# Altium project Motor_Driver_Model_D203.PrjPcb (part 1 of 2)
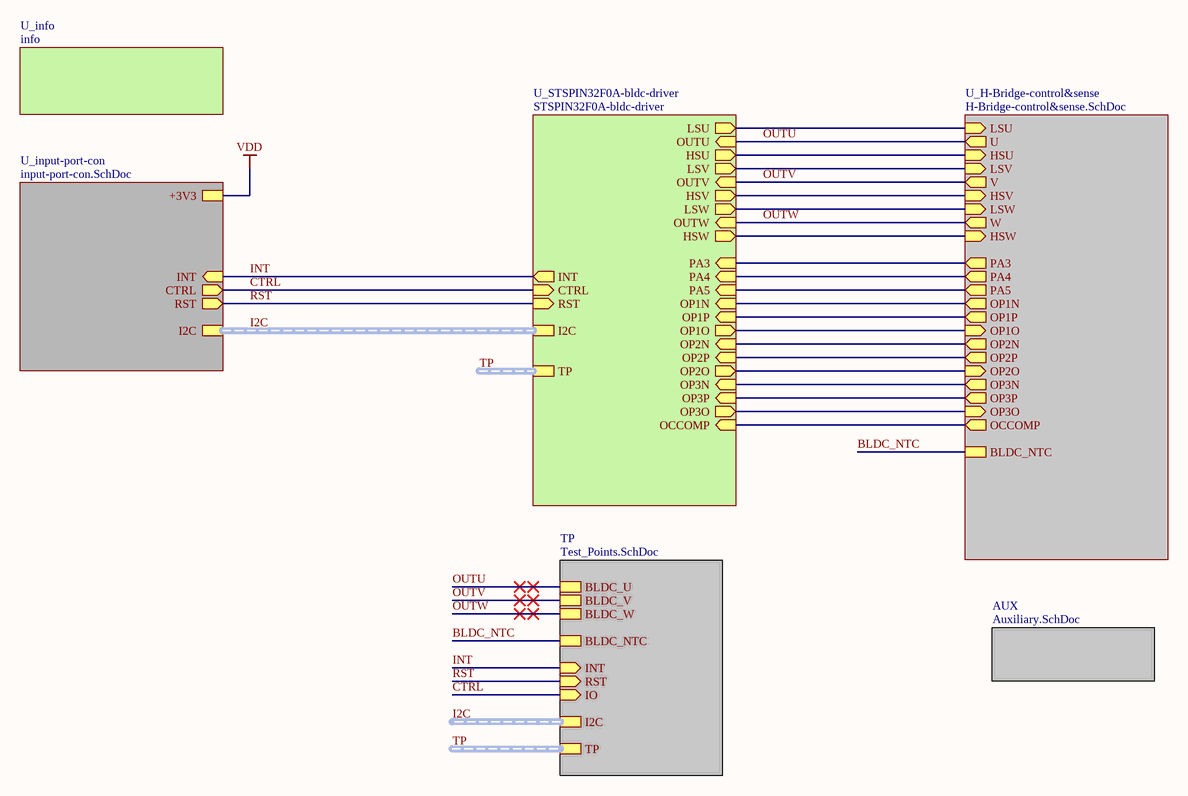
[diagram p0: Top_Motor_Driver_Model_D203.SchDoc]
_Title: D203_Motor_Driver; _Revision: 0.1; _PCBNumber: 001; _PCBModel: D203; _HWEngineer: SGU; _DocumentDate: 20213105; _DateCode: 2021.30; _CompanyName: Acme_CPU; _BoardName: Motor_Driver; _address2: Sheridan WY 82801; _address1: 30 N Gould St suite 4000
7 sheets, 106 parts. Net scope: hierarchical (ports join the sheet entries above them; power ports are global).
Board file: Motor_Driver_Model_D203.PcbDoc
Sheets:
  Top_Motor_Driver_Model_D203.SchDoc
    TP = Test_Points.SchDoc
    AUX = Auxiliary.SchDoc
    U_input-port-con = input-port-con.SchDoc
    U_H-Bridge-control&sense = H-Bridge-control&sense.SchDoc
  SWD_TagConnect.SchDoc
    U_TC2030-NL_TagConnect_6-pin = TC2030-NL_TagConnect_6-pin.SchDoc

## Sheet Top_Motor_Driver_Model_D203.SchDoc: TOP-Motor-Driver-Sch
size A4; DocumentNumber: 2; SheetNumber: 2; SheetTotal: 8

### Sub-sheets
AUX = Auxiliary.SchDoc: no entries
TP = Test_Points.SchDoc: BLDC_U, BLDC_W, BLDC_V, I2C (harness I2C), BLDC_NTC, TP (harness TP), INT (in), RST (in), IO (in)
U_H-Bridge-control&sense = H-Bridge-control&sense.SchDoc: U (out), V (out), W (out), PA3 (out), PA4 (out), PA5 (out), OP1N (out), OP1P (out), OP1O (in), OP2N (out), OP2P (out), OP2O (in), OP3N (out), OP3P (out), OP3O (in), OCCOMP (out), HSU (in), LSU (in), HSV (in), LSV (in), HSW (in), LSW (in), BLDC_NTC
U_info = info (file not in this document): no entries
U_input-port-con = input-port-con.SchDoc: I2C (harness I2C), INT (in), RST (out), CTRL (out), +3V3
U_STSPIN32F0A-bldc-driver = STSPIN32F0A-bldc-driver (file not in this document): TP (harness TP), LSU (out), OUTU (in), HSU (out), LSV (out), OUTV (in), HSV (out), LSW (out), OUTW (in), HSW (out), RST (in), INT (out), CTRL (in), I2C (harness I2C), PA3 (in), PA4 (in), PA5 (in), OP1N (in), OP1P (in), OP1O (out), OP2N (in), OP2P (in), OP2O (out), OP3N (in), OP3P (in), OP3O (out), OCCOMP (in)

### Nets
BLDC_NTC: sheet TP/BLDC_NTC, sheet U_H-Bridge-control&sense/BLDC_NTC
CTRL: sheet TP/IO, sheet U_input-port-con/CTRL, sheet U_STSPIN32F0A-bldc-driver/CTRL
HSU: sheet U_H-Bridge-control&sense/HSU, sheet U_STSPIN32F0A-bldc-driver/HSU
HSV: sheet U_H-Bridge-control&sense/HSV, sheet U_STSPIN32F0A-bldc-driver/HSV
HSW: sheet U_H-Bridge-control&sense/HSW, sheet U_STSPIN32F0A-bldc-driver/HSW
INT: sheet TP/INT, sheet U_input-port-con/INT, sheet U_STSPIN32F0A-bldc-driver/INT
LSU: sheet U_H-Bridge-control&sense/LSU, sheet U_STSPIN32F0A-bldc-driver/LSU
LSV: sheet U_H-Bridge-control&sense/LSV, sheet U_STSPIN32F0A-bldc-driver/LSV
LSW: sheet U_H-Bridge-control&sense/LSW, sheet U_STSPIN32F0A-bldc-driver/LSW
OCCOMP: sheet U_H-Bridge-control&sense/OCCOMP, sheet U_STSPIN32F0A-bldc-driver/OCCOMP
OP1N: sheet U_H-Bridge-control&sense/OP1N, sheet U_STSPIN32F0A-bldc-driver/OP1N
OP1O: sheet U_H-Bridge-control&sense/OP1O, sheet U_STSPIN32F0A-bldc-driver/OP1O
OP1P: sheet U_H-Bridge-control&sense/OP1P, sheet U_STSPIN32F0A-bldc-driver/OP1P
OP2N: sheet U_H-Bridge-control&sense/OP2N, sheet U_STSPIN32F0A-bldc-driver/OP2N
OP2O: sheet U_H-Bridge-control&sense/OP2O, sheet U_STSPIN32F0A-bldc-driver/OP2O
OP2P: sheet U_H-Bridge-control&sense/OP2P, sheet U_STSPIN32F0A-bldc-driver/OP2P
OP3N: sheet U_H-Bridge-control&sense/OP3N, sheet U_STSPIN32F0A-bldc-driver/OP3N
OP3O: sheet U_H-Bridge-control&sense/OP3O, sheet U_STSPIN32F0A-bldc-driver/OP3O
OP3P: sheet U_H-Bridge-control&sense/OP3P, sheet U_STSPIN32F0A-bldc-driver/OP3P
OUTU: sheet TP/BLDC_U, sheet U_H-Bridge-control&sense/U, sheet U_STSPIN32F0A-bldc-driver/OUTU  [project net BLDC_U]
OUTV: sheet TP/BLDC_V, sheet U_H-Bridge-control&sense/V, sheet U_STSPIN32F0A-bldc-driver/OUTV  [project net BLDC_V]
OUTW: sheet TP/BLDC_W, sheet U_H-Bridge-control&sense/W, sheet U_STSPIN32F0A-bldc-driver/OUTW  [project net BLDC_W]
PA3: sheet U_H-Bridge-control&sense/PA3, sheet U_STSPIN32F0A-bldc-driver/PA3
PA4: sheet U_H-Bridge-control&sense/PA4, sheet U_STSPIN32F0A-bldc-driver/PA4
PA5: sheet U_H-Bridge-control&sense/PA5, sheet U_STSPIN32F0A-bldc-driver/PA5
RST: sheet TP/RST, sheet U_input-port-con/RST, sheet U_STSPIN32F0A-bldc-driver/RST

### Buses and harness runs
harness I2C =  = sheet TP/I2C
harness I2C = sheet U_input-port-con/I2C = sheet U_STSPIN32F0A-bldc-driver/I2C
harness TP = sheet TP/TP
harness TP = sheet U_STSPIN32F0A-bldc-driver/TP

### Notes on the sheet
- Title:
- Number:
- Size:
- Date:
- A4
- Time:
- Revision:
- Sheet
- File:
- of

## Sheet Test_Points.SchDoc: Test Points
size A4; DocumentNumber: 7; SheetNumber: 7; SheetTotal: 8
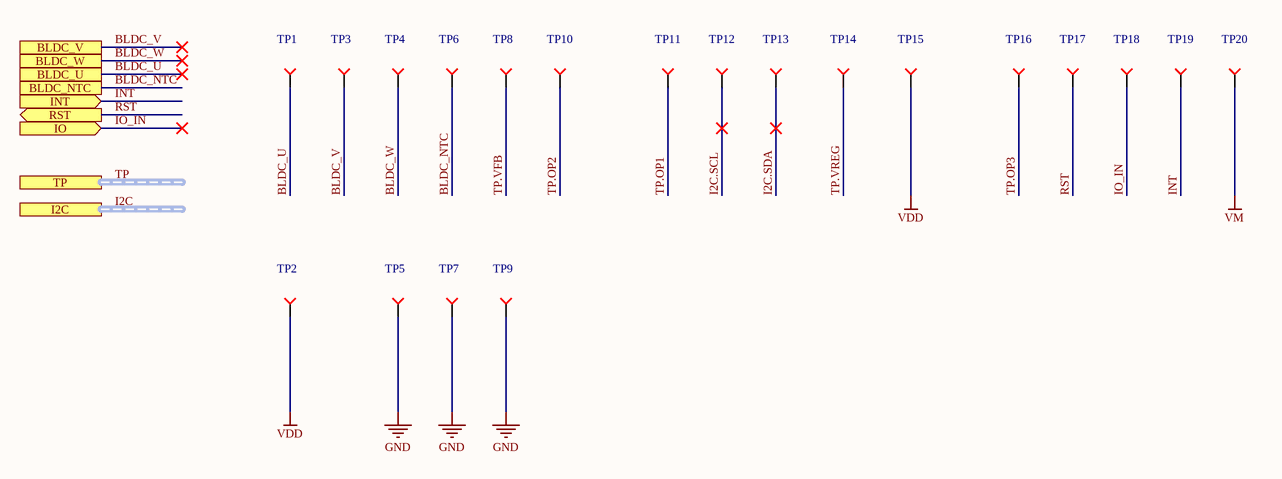
[diagram p1: Test_Points.SchDoc]

### Parts
TP1  Test Point Pad  [Testpoint]  (value not drawn)  (no BOM)
TP2  Test Point Pad  [Testpoint]  (value not drawn)  (no BOM)
TP3  Test Point Pad  [Testpoint]  (value not drawn)  (no BOM)
TP4  Test Point Pad  [Testpoint]  (value not drawn)  (no BOM)
TP5  Test Point Pad  [Testpoint]  (value not drawn)  (no BOM)
TP6  Test Point Pad  [Testpoint]  (value not drawn)  (no BOM)
TP7  Test Point Pad  [Testpoint]  (value not drawn)  (no BOM)
TP8  Test Point Pad  [Testpoint]  (value not drawn)  (no BOM)
TP9  Test Point Pad  [Testpoint]  (value not drawn)  (no BOM)
TP10  Test Point Pad  [Testpoint]  (value not drawn)  (no BOM)
TP11  Test Point Pad  [Testpoint]  (value not drawn)  (no BOM)
TP12  Test Point Pad  [Testpoint]  (value not drawn)  (no BOM)
TP13  Test Point Pad  [Testpoint]  (value not drawn)  (no BOM)
TP14  Test Point Pad  [Testpoint]  (value not drawn)  (no BOM)
TP15  Test Point Pad  [Testpoint]  (value not drawn)  (no BOM)
TP16  Test Point Pad  [Testpoint]  (value not drawn)  (no BOM)
TP17  Test Point Pad  [Testpoint]  (value not drawn)  (no BOM)
TP18  Test Point Pad  [Testpoint]  (value not drawn)  (no BOM)
TP19  Test Point Pad  [Testpoint]  (value not drawn)  (no BOM)
TP20  Test Point Pad  [Testpoint]  (value not drawn)  (no BOM)

### Ports
BLDC_NTC, BLDC_U, BLDC_V, BLDC_W, I2C (harness I2C), INT (in), IO (in), RST (out), TP (harness TP)

### Nets
GND: TP5.1 TP7.1 TP9.1
VDD: TP2.1 TP15.1  [project net +3V3]
VM: TP20.1
BLDC_NTC: TP6.1 ; port BLDC_NTC
BLDC_U: TP1.1 ; port BLDC_U
BLDC_V: TP3.1 ; port BLDC_V
BLDC_W: TP4.1 ; port BLDC_W
I2C.SCL: TP12.1
I2C.SDA: TP13.1
INT: TP19.1 ; port INT
IO_IN: TP18.1 ; port IO  [project net CTRL]
RST: TP17.1 ; port RST
TP.OP1: TP11.1
TP.OP2: TP10.1
TP.OP3: TP16.1
TP.VFB: TP8.1
TP.VREG: TP14.1

### Buses and harness runs
harness I2C = port I2C
harness TP = port TP

### Notes on the sheet
- Title:
- Number:
- Size:
- Date:
- A4
- Time:
- Revision:
- Sheet
- File:
- of

### Library data of the parts
TP1-TP20 = Test Point Pad: Test Point. There is nothing to buy or mount.; ClassName: TestPoint; CompType: TestPoint; Manufacturer: N/A; MountType: N/A; PackageReference: TetsPoint; PartNumber: N/A

## Sheet Auxiliary.SchDoc: Auxiliary Components
size A4; DocumentNumber: 8; SheetNumber: 8; SheetTotal: 8
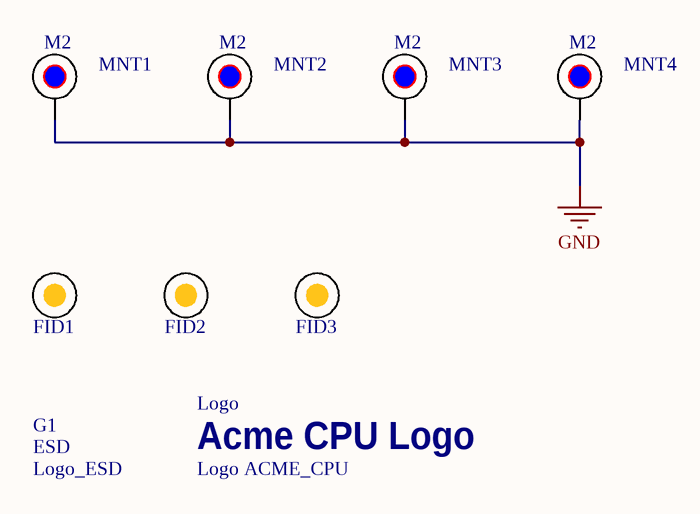
[diagram p2: Auxiliary.SchDoc]

### Parts
FID1  N/A  [Fiducial]  (value not drawn)  (no BOM)
FID2  N/A  [Fiducial]  (value not drawn)  (no BOM)
FID3  N/A  [Fiducial]  (value not drawn)  (no BOM)
G1  Logo_ESD  [Logo_ESD]  (no BOM)
Logo  Logo ACME_CPU  [LOGO_ACME_CPU]  (no BOM)
MNT1  MountHole M2. Nothing to buy or mount  [MountHole_M2]  (value not drawn)  (no BOM)
MNT2  MountHole M2. Nothing to buy or mount  [MountHole_M2]  (value not drawn)  (no BOM)
MNT3  MountHole M2. Nothing to buy or mount  [MountHole_M2]  (value not drawn)  (no BOM)
MNT4  MountHole M2. Nothing to buy or mount  [MountHole_M2]  (value not drawn)  (no BOM)

### Nets
GND: MNT1.1 MNT2.1 MNT3.1 MNT4.1

### Notes on the sheet
- Title:
- Number:
- Size:
- Date:
- A4
- Time:
- Revision:
- Sheet
- File:
- of
- (in symbol Logo ACME_CPU) Acme CPU Logo
- (in symbol Logo_ESD) ESD
- (in symbol MountHole_M2) M2

### Library data of the parts
FID1-FID3 = Fiducial: Fiducial mark.  There is nothing to buy or mount.; CompType: Fiducial; Manufacturer: N/A; MountType: N/A; PackageReference: Fiducial; Manufacturer Part Number: N/A; ClassName: PCB_FEATURE
MNT1-MNT4 = MountHole_M2: PCB Mount Hole. There is nothing to buy or mount.
G1 = Logo_ESD: ClassName: PCB_FEATURE
Logo = Logo ACME_CPU: ClassName: PCB_FEATURE

## Sheet input-port-con.SchDoc: Input Port Connection
size A4
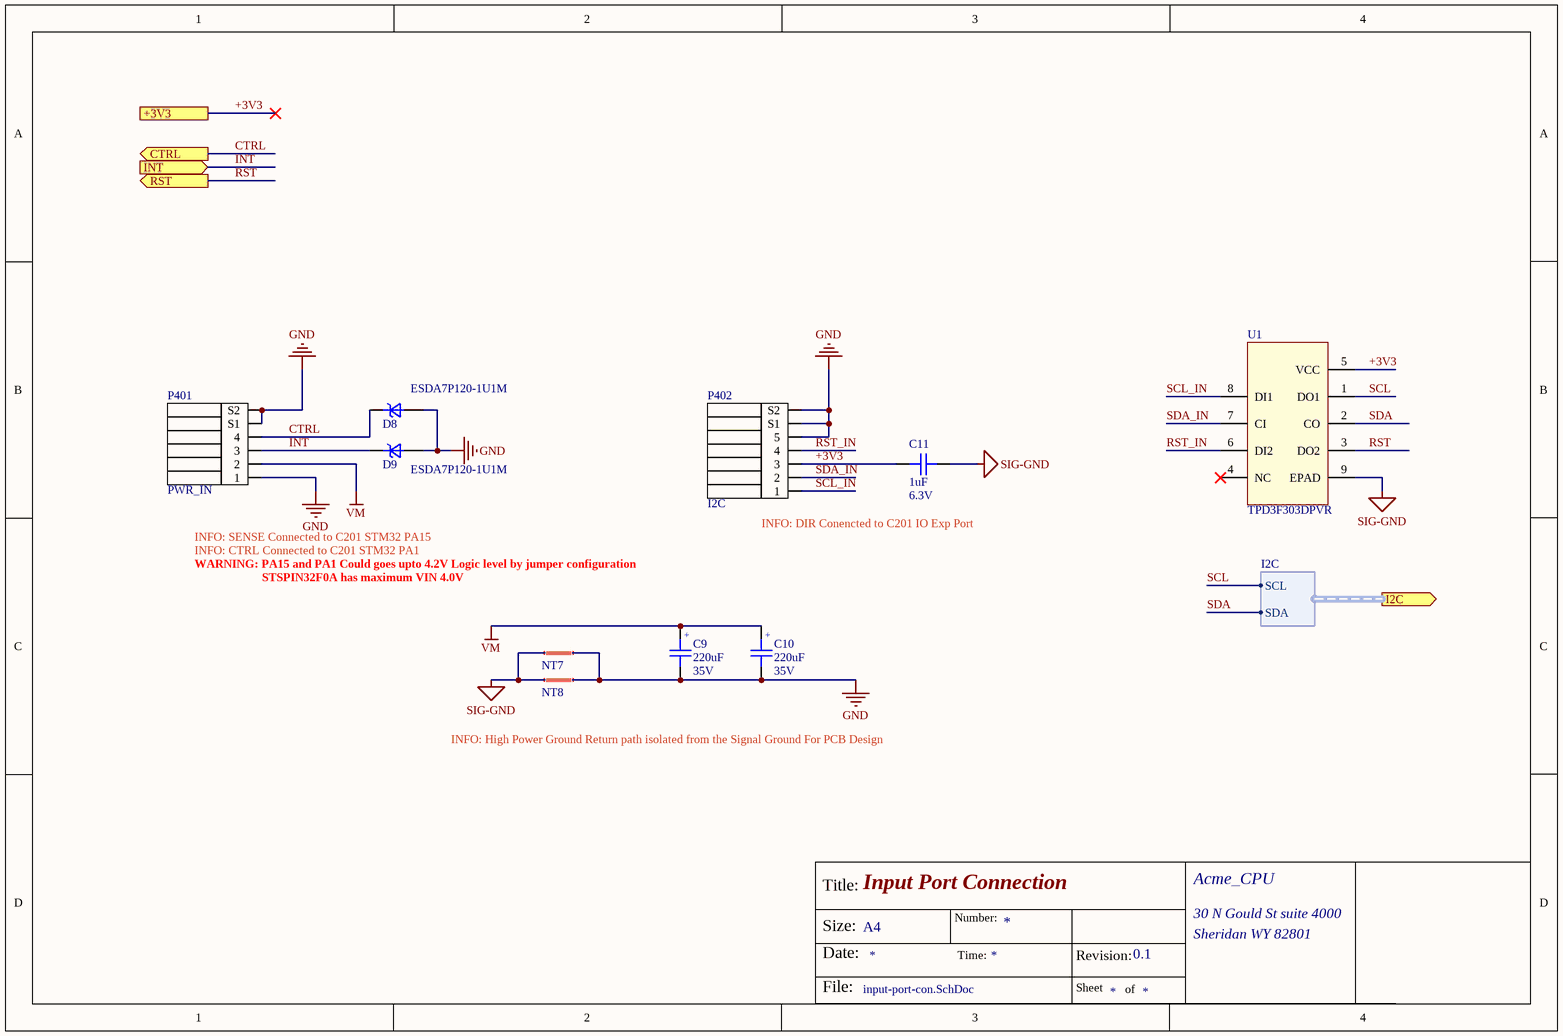
[diagram p3: input-port-con.SchDoc]

### Parts
C9  Capacitance: 220uF  Rated Voltage: 35V  [WCAP-ASLI_D8H10.5]  (hidden comment: CAP ALUM 220 UF 20% 35 V SMD)
C10  Capacitance: 220uF  Rated Voltage: 35V  [WCAP-ASLI_D8H10.5]  (hidden comment: CAP ALUM 220 UF 20% 35 V SMD)
C11  Capacitance: 1uF  Voltage Rating: 6.3V  [C0402]  (hidden comment: CAP CER 1UF 6.3V X5R 0402)
D8  ESDA7P120-1U1M  [ST_QFN_1610]
D9  ESDA7P120-1U1M  [ST_QFN_1610]
NT7  Net Tie  [Net Tie 6x30mil]  (value not drawn)  (net tie, no BOM)
NT8  Net Tie  [Net Tie 6x30mil]  (value not drawn)  (net tie, no BOM)
P401  PWR_IN  [JST_S4B-ZR-SM4A-TF(LF)(SN)]
P402  I2C  [JST_S5B-ZR-SM4A-TF(LF)(SN)]
U1  TPD3F303DPVR  [DPV8_1P7X0P4]

### Ports
+3V3, CTRL (out), I2C (out, harness I2C), INT (in), RST (out)

### Harnesses
I2C: SCL, SDA

### Nets
+3V3: C11.2 P402.3 U1.5(VCC) ; port +3V3
GND: C9.2 C10.2 D8.2(A) D9.2(A) NT7.2 NT8.2 P401.1 P401.S1 P401.S2 P402.5 P402.S1 P402.S2
SIG-GND: C11.1 NT7.1 NT8.1 U1.9(EPAD)
VM: C9.1 C10.1 P401.2
CTRL: D8.1(K) P401.4 ; port CTRL
INT: D9.1(K) P401.3 ; port INT
RST: U1.3(DO2) ; port RST
RST_IN: P402.4 U1.6(DI2)
SCL: U1.1(DO1) ; port I2C.SCL  [project net I2C.SCL]
SCL_IN: P402.1 U1.8(DI1)
SDA: U1.2(CO) ; port I2C.SDA  [project net I2C.SDA]
SDA_IN: P402.2 U1.7(CI)

Not connected (* = marked no-connect by the designer): U1 4(NC)*

### Notes on the sheet
- INFO: SENSE Connected to C201 STM32 PA15
- WARNING: PA15 and PA1 Could goes upto 4.2V Logic level by jumper configuration
- INFO: CTRL Connected to C201 STM32 PA1
- STSPIN32F0A has maximum VIN 4.0V
- (near P402) INFO: DIR Conencted to C201 IO Exp Port
- INFO: High Power Ground Return path isolated from the Signal Ground For PCB Design
- Title:
- Number:
- Size:
- Date:
- A4
- Time:
- Revision:
- Sheet
- File:
- of
- (in symbol CAP ALUM 220 UF 20% 35 V SMD) +

### Library data of the parts
C9 C10 = CAP ALUM 220 UF 20% 35 V SMD: 220µF 35V Aluminum Electrolytic Capacitors Radial, Can - SMD  2000 Hrs @ 105°C; Manufacturer: Wurth Elektronik; Manufacturer Part Number: 865080553014; Dissipation Factor: 14%; Endurance: 2000h; Leakage Current: 77uA; Ripple Current: 570mA; Capacitance Tolerance: +/-20%; Packaging: Tape and Reel; ComponentLink1URL: http://www.we-online.de; ComponentLink1Description: Manufacturer; Diameter: 8mm; Height: 10mm; ComponentLink2URL: https://www.we-online.com/catalog/datasheet/865080553014.pdf; ComponentLink2Description: Datasheet; Mounting Technology: SMT; Operating Temperature: -55 to +105degC; Published Date: Nov 2014; Mount: Surface Mount; Supplier 1: Digi-Key; Supplier Part Number 1: 732-8513-1-ND
C11 = CAP CER 1UF 6.3V X5R 0402: 1µF ±10% 6.3V Ceramic Capacitor X5R 0402 (1005 Metric); Manufacturer: Yageo; Manufacturer Part Number: CC0402KRX5R5BB105; Supplier 1: Digi-Key; Stock 1: 34926286; Pricing 1: 1=0.1, 10=0.05, 50=0.0272, 100=0.0222, 500=0.0158, 1000=0.0124, 2500=0.0113, 5000=0.0104 (USD); Mount: Surface Mount; Number of Pins: 2; Case Code (Imperial): 0402; Case Code (Metric): 1005; Min Operating Temperature: -55°C; Max Operating Temperature: 85°C; Tolerance: 10%; Packaging: Tape and Reel; Termination: SMD/SMT; Voltage Rating (DC): 6.3V; Composition: Ceramic; Length: 1mm; Height: 0.5mm; Width: 0.02inch; Thickness: 0.022inch; Depth: 0.5mm; Radiation Hardening: No; Lead Free: Lead Free; Halogen Free: Halogen Free; ComponentLink1URL: http://www.farnell.com/datasheets/70765.pdf?src-supplier=Farnell; ComponentLink1Description: http://www.farnell.com/datasheets/70765.pdf?src-supplier=Farnell; Supplier Part Number 1: 311-1438-1-ND; Dielectric: X5R; Case/Package: 0402; Dielectric Material: Ceramic; Package Quantity: 1; REACH SVHC: No SVHC; ComponentLink2URL: http://www.yageo.com/documents/recent/UPY-GPHC_X5R_4V-to-50V_25.pdf?src-supplier=Digi-Key; ComponentLink2Description: http://www.yageo.com/documents/recent/UPY-GPHC_X5R_4V-to-50V_25.pdf?src-supplier=Digi-Key; ComponentLink3URL: http://www.farnell.com/datasheets/2167237.pdf?src-supplier=Element14; ComponentLink3Description: http://www.farnell.com/datasheets/2167237.pdf?src-supplier=Element14; ComponentLink4URL: http://www.yageo.com/documents/recent/UPY-GPHC_X5R_4V-to-50V_12.pdf?src-supplier=Avnet+Europe; ComponentLink4Description: http://www.yageo.com/documents/recent/UPY-GPHC_X5R_4V-to-50V_12.pdf?src-supplier=Avnet+Europe; ComponentLink5URL: http://www.farnell.com/datasheets/1359354.pdf?src-supplier=Element14; ComponentLink5Description: http://www.farnell.com/datasheets/1359354.pdf?src-supplier=Element14; ComponentLink6URL: http://www.farnell.com/datasheets/70765.pdf?src-supplier=Element14; ComponentLink6Description: http://www.farnell.com/datasheets/70765.pdf?src-supplier=Element14; ComponentLink7URL: http://www.yageo.com/documents/recent/UPY-GPHC_X5R_4V-to-50V_12.pdf?src-supplier=Avnet; ComponentLink7Description: http://www.yageo.com/documents/recent/UPY-GPHC_X5R_4V-to-50V_12.pdf?src-supplier=Avnet
D8 D9 = TVS DIODE ESDA7P120-1U1M 5.5V 11.5V 1610: 11.5V Clamp 120A (8/20µs) Ipp Tvs Diode Surface Mount 1610; Manufacturer: STMicroelectronics; Number of Unidirectional Channels: 1; Reverse Standoff Voltage: 5.5V; Min Breakdown Voltage: 6.4V; Peak Pulse Power: 1.4kW; Power Line Protection: No; Supplier 1: Digi-Key; Manufacturer Part Number: ESDA7P120-1U1M; Stock 1: 15775; Pricing 1: 1=0.35, 10=0.287, 25=0.2624, 100=0.1647, 250=0.1629, 500=0.1525, 1000=0.1037, 2500=0.0994 (USD); Mount: Surface Mount; Case/Package: 0603; Case Code (Imperial): 0603; Case Code (Metric): 1610; Min Operating Temperature: -55°C; Max Operating Temperature: 150°C; Composition: Zener; Packaging: Cut Tape; Clamping Voltage: 11.5V; Peak Pulse Current: 120A; ComponentLink1URL: http://www.st.com/content/ccc/resource/technical/document/datasheet/group3/5e/7c/5d/76/3f/de/45/35/DM00359316/files/DM00359316.pdf/jcr:content/translations/en.DM00359316.pdf?src-supplier=Digi-Key; ComponentLink1Description: http://www.st.com/content/ccc/resource/technical/document/datasheet/group3/5e/7c/5d/76/3f/de/45/35/DM00359316/files/DM00359316.pdf/jcr:content/translations/en.DM00359316.pdf?src-supplier=Digi-Key; ComponentLink2URL: http://www.farnell.com/datasheets/2815837.pdf?src-supplier=Newark; ComponentLink2Description: http://www.farnell.com/datasheets/2815837.pdf?src-supplier=Newark; ComponentLink3URL: http://www.farnell.com/datasheets/2815837.pdf?src-supplier=Farnell; ComponentLink3Description: http://www.farnell.com/datasheets/2815837.pdf?src-supplier=Farnell; ComponentLink4URL: http://www.farnell.com/datasheets/2815837.pdf?src-supplier=Element14; ComponentLink4Description: http://www.farnell.com/datasheets/2815837.pdf?src-supplier=Element14; Supplier Part Number 1: 497-17159-1-ND
NT7 NT8 = Net Tie Line: ClassName: STM32G473CETx
P401 = JST_S4B-ZR-SM4A-TF(LF)(SN): Connector Header SMD, Right Angle 4 position 0.059" (1.50mm); Manufacturer: JST; Manufacturer Part Number: S5B-ZR-SM4A-TF; Body Plating: Tin; Number of Positions: 4; Connector Type: Header,Male Pin; Voltage Rating: 50V; Contact Resistance: 30mR; Max Current Rating: 1A; Insulation Resistance: 500MR; Gender: Male; Pitch: 1.5mm; Panel Thickness: 3.5mm; Stock 1: 0; Mount: Surface Mount; Number of Pins: 4; Color: White; Contact Plating: Tin,Copper; Contact Material: Brass,Tin,Copper; Material: Nylon; Housing Color: Beige; Housing Material: Polyamide; Contact Shape: Circular; Insulation Material: Nylon; Insulation Color: Natural; Min Operating Temperature: -25°C; Max Operating Temperature: 85°C; Packaging: Bulk; Number of Rows: 1; Termination: Solder; Voltage Rating (DC): 50V; Current Rating: 1A; Voltage Rating (AC): 50V; Fastening Type: Detent; Max Voltage Rating (AC): 50V; Max Voltage Rating (DC): 50V; Number of Contacts: 4; Orientation: Right Angle; Length: 7.5mm; Height: 7.2mm; Width: 3.5mm; Depth: 6mm; Lead Pitch: 1.5mm; Contact Mating Length: 0.094inch; REACH SVHC: No SVHC; Lead Free: Lead Free; Flammability Rating: UL94 V-0; ComponentLink4URL: http://www.jst-mfg.com/product/pdf/eng/eZH.pdf?src-supplier=Digi-Key; ComponentLink4Description: http://www.jst-mfg.com/product/pdf/eng/eZH.pdf?src-supplier=Digi-Key; Supplier 1: RSComponents; Supplier Part Number 1: 7620881P
P402 = JST_S5B-ZR-SM4A-TF(LF)(SN): Connector Header SMD, Right Angle 4 position 0.059" (1.50mm); Manufacturer: JST; Body Plating: Tin; Number of Positions: 4; Connector Type: Header,Male Pin; Voltage Rating: 50V; Contact Resistance: 30mR; Max Current Rating: 1A; Insulation Resistance: 500MR; Gender: Male; Pitch: 1.5mm; Panel Thickness: 3.5mm; Manufacturer Part Number: S5B-ZR-SM4A-TF; Stock 1: 0; Mount: Surface Mount; Number of Pins: 4; Color: White; Contact Plating: Tin,Copper; Contact Material: Brass,Tin,Copper; Material: Nylon; Housing Color: Beige; Housing Material: Polyamide; Contact Shape: Circular; Insulation Material: Nylon; Insulation Color: Natural; Min Operating Temperature: -25°C; Max Operating Temperature: 85°C; Packaging: Bulk; Number of Rows: 1; Termination: Solder; Voltage Rating (DC): 50V; Current Rating: 1A; Voltage Rating (AC): 50V; Fastening Type: Detent; Max Voltage Rating (AC): 50V; Max Voltage Rating (DC): 50V; Number of Contacts: 4; Orientation: Right Angle; Length: 7.5mm; Height: 7.2mm; Width: 3.5mm; Depth: 6mm; Lead Pitch: 1.5mm; Contact Mating Length: 0.094inch; REACH SVHC: No SVHC; Lead Free: Lead Free; Flammability Rating: UL94 V-0; ComponentLink4URL: https://www.jst-mfg.com/product/pdf/eng/eZH.pdf; ComponentLink4Description: http://www.jst-mfg.com/product/pdf/eng/eZH.pdf?src-supplier=Digi-Key; Supplier 1: RSComponents; Supplier Part Number 1: 7620881P
U1 = FILTER RC(PI) ESD SMD  8-UFDFN EP: RC (Pi) EMI Filter 2nd Order Low Pass 3 Channel R = 47Ohms, 100Ohms, C = 20pF  8-UFDFN Exposed Pad; Manufacturer: Texas Instruments; Number of Channels: 3; Frequency: 308MHz; ESD Protection: Yes; Operating Supply Voltage: 5.5V; Clamping Voltage: 10V; Supplier 1: Digi-Key; Manufacturer Part Number: TPD3F303DPVR; Stock 1: 4896; Pricing 1: 1=0.85, 10=0.812, 25=0.7856, 50=0.6414, 100=0.576, 250=0.5236, 500=0.4974, 1000=0.4451 (USD); Case/Package: SMD/SMT; Min Operating Temperature: -40°C; Max Operating Temperature: 85°C; Packaging: Tape and Reel; ComponentLink1URL: http://www.ti.com/lit/ds/symlink/tpd3f303.pdf?src-supplier=Digi-Key; ComponentLink1Description: http://www.ti.com/lit/ds/symlink/tpd3f303.pdf?src-supplier=Digi-Key; ComponentLink2URL: http://focus.ti.com/lit/ds/symlink/tpd3f303.pdf?src-supplier=Avnet+Europe; ComponentLink2Description: http://focus.ti.com/lit/ds/symlink/tpd3f303.pdf?src-supplier=Avnet+Europe; ComponentLink3URL: https://www.verical.com/server-webapp/html/getDatasheet?partID=302817&src-supplier=Verical; ComponentLink3Description: https://www.verical.com/server-webapp/html/getDatasheet?partID=302817&src-supplier=Verical; ComponentLink4URL: http://www.farnell.com/datasheets/1558442.pdf?src-supplier=Element14; ComponentLink4Description: http://www.farnell.com/datasheets/1558442.pdf?src-supplier=Element14; Supplier Part Number 1: 296-28299-1-ND; Number of Pins: 8; Contact Plating: Gold; Package Quantity: 1; Capacitance: 20pF; Termination: Flat; Length: 2.2mm; Height: 0.026inch; Width: 0.063inch; Depth: 1.7mm; Radiation Hardening: No; Lead Free: Lead Free; REACH SVHC: No SVHC; Mount: Surface Mount

## Sheet H-Bridge-control&sense.SchDoc: H-Bridge-control&sense-outut-sch
size A3; DocumentNumber: 4; SheetNumber: 4; SheetTotal: 8
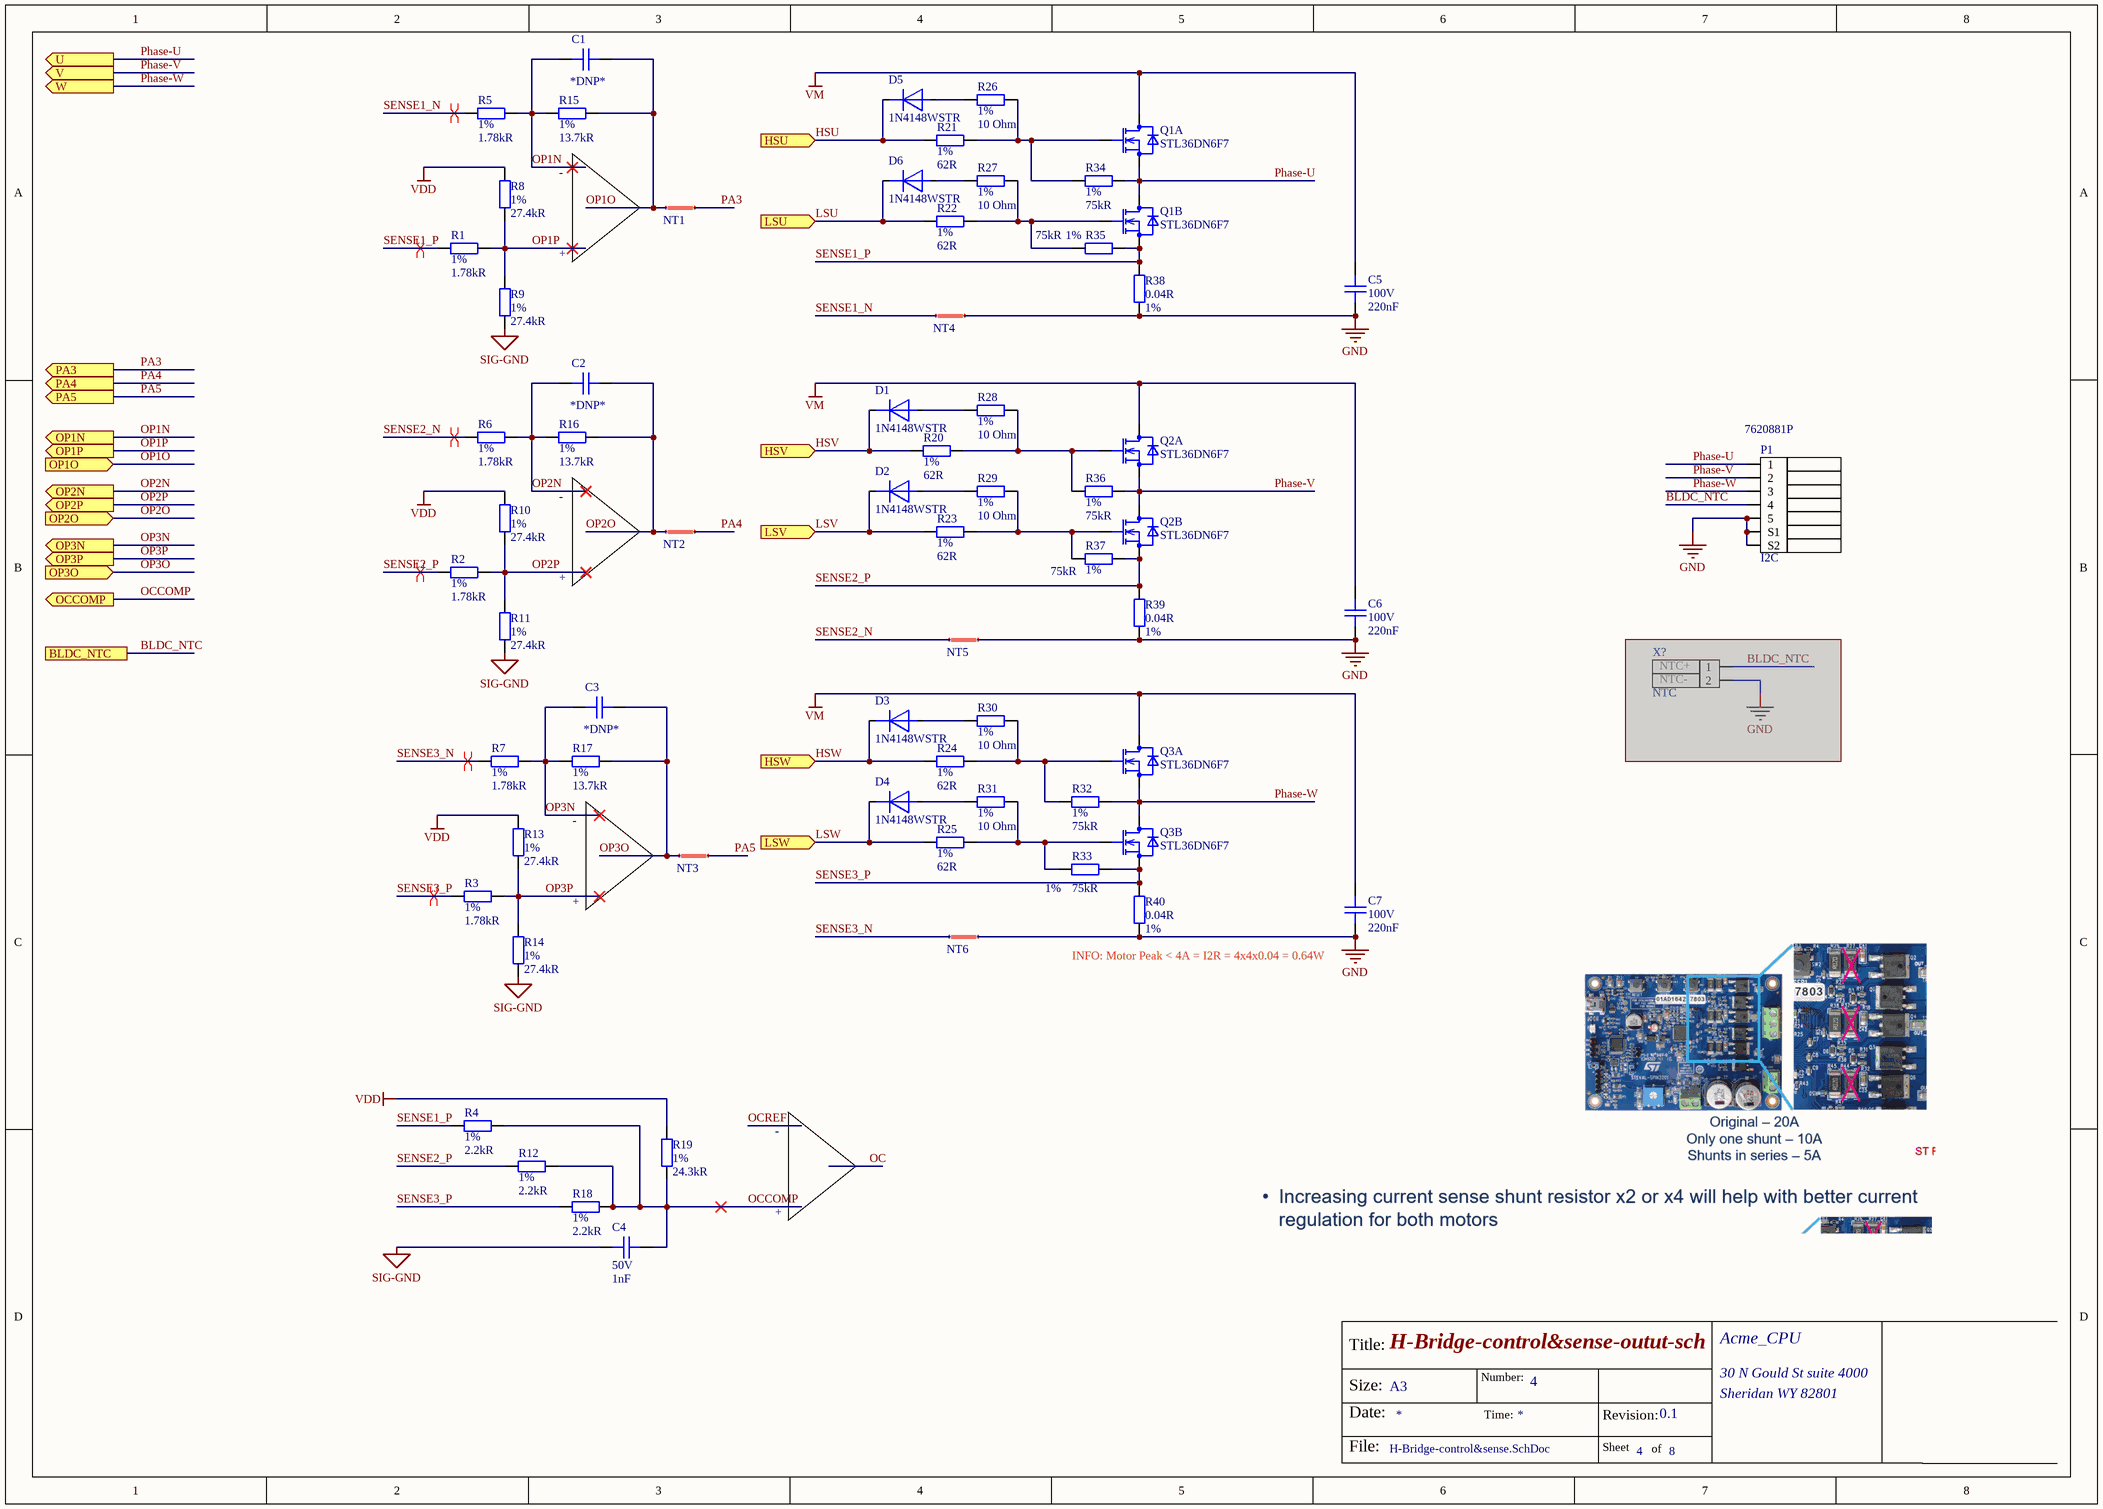
[diagram p4: H-Bridge-control&sense.SchDoc]

### Parts
C1  Capacitance: *DNP*  [C0402]  (hidden comment: C 100pF 50V C0G, NP0 0402)
C2  Capacitance: *DNP*  [C0402]  (hidden comment: C 100pF 50V C0G, NP0 0402)
C3  Capacitance: *DNP*  [C0402]  (hidden comment: C 100pF 50V C0G, NP0 0402)
C4  Voltage Rating (DC): 50V  Capacitance: 1nF  [C0402]  (hidden comment: CAP CER 1000PF 50V X7R 0402)
C5  Voltage Rating: 100V  Capacitance: 220nF  [C0805]  (hidden comment: CAP CER 220nF 10V X7R 0805)
C6  Voltage Rating: 100V  Capacitance: 220nF  [C0805]  (hidden comment: CAP CER 220nF 10V X7R 0805)
C7  Voltage Rating: 100V  Capacitance: 220nF  [C0805]  (hidden comment: CAP CER 220nF 10V X7R 0805)
D1  1N4148WSTR  [SODFL2512X100N]
D2  1N4148WSTR  [SODFL2512X100N]
D3  1N4148WSTR  [SODFL2512X100N]
D4  1N4148WSTR  [SODFL2512X100N]
D5  1N4148WSTR  [SODFL2512X100N]
D6  1N4148WSTR  [SODFL2512X100N]
NT1  Net Tie  [Net Tie 6x30mil]  (value not drawn)  (net tie, no BOM)
NT2  Net Tie  [Net Tie 6x30mil]  (value not drawn)  (net tie, no BOM)
NT3  Net Tie  [Net Tie 6x30mil]  (value not drawn)  (net tie, no BOM)
NT4  Net Tie  [Net Tie 6x30mil]  (value not drawn)  (net tie, no BOM)
NT5  Net Tie  [Net Tie 6x30mil]  (value not drawn)  (net tie, no BOM)
NT6  Net Tie  [Net Tie 6x30mil]  (value not drawn)  (net tie, no BOM)
P1  I2C  Supplier Part Number 1: 7620881P  [JST_S5B-ZR-SM4A-TF(LF)(SN)]
Q1  STL36DN6F7  [POWERFLAT-5x6]  (parts A,B of 2)
Q2  STL36DN6F7  [POWERFLAT-5x6]  (parts A,B of 2)
Q3  STL36DN6F7  [POWERFLAT-5x6]  (parts A,B of 2)
R1  Tolerance: 1%  Resistance: 1.78kR  [R0402]  (hidden comment: RES SMD 1.78K OHM 1% 1/10W 0402)
R2  Tolerance: 1%  Resistance: 1.78kR  [R0402]  (hidden comment: RES SMD 1.78K OHM 1% 1/10W 0402)
R3  Tolerance: 1%  Resistance: 1.78kR  [R0402]  (hidden comment: RES SMD 1.78K OHM 1% 1/10W 0402)
R4  Tolerance: 1%  Resistance: 2.2kR  [R0402]  (hidden comment: RES SMD 2.2 KOHM 1% 1/10W 0402)
R5  Tolerance: 1%  Resistance: 1.78kR  [R0402]  (hidden comment: RES SMD 1.78K OHM 1% 1/10W 0402)
R6  Tolerance: 1%  Resistance: 1.78kR  [R0402]  (hidden comment: RES SMD 1.78K OHM 1% 1/10W 0402)
R7  Tolerance: 1%  Resistance: 1.78kR  [R0402]  (hidden comment: RES SMD 1.78K OHM 1% 1/10W 0402)
R8  Tolerance: 1%  Resistance: 27.4kR  [R0402]  (hidden comment: RES SMD 27.4K OHM 1% 1/10W 0402)
R9  Tolerance: 1%  Resistance: 27.4kR  [R0402]  (hidden comment: RES SMD 27.4K OHM 1% 1/10W 0402)
R10  Tolerance: 1%  Resistance: 27.4kR  [R0402]  (hidden comment: RES SMD 27.4K OHM 1% 1/10W 0402)
R11  Tolerance: 1%  Resistance: 27.4kR  [R0402]  (hidden comment: RES SMD 27.4K OHM 1% 1/10W 0402)
R12  Tolerance: 1%  Resistance: 2.2kR  [R0402]  (hidden comment: RES SMD 2.2 KOHM 1% 1/10W 0402)
R13  Tolerance: 1%  Resistance: 27.4kR  [R0402]  (hidden comment: RES SMD 27.4K OHM 1% 1/10W 0402)
R14  Tolerance: 1%  Resistance: 27.4kR  [R0402]  (hidden comment: RES SMD 27.4K OHM 1% 1/10W 0402)
R15  Tolerance: 1%  Resistance: 13.7kR  [R0402]  (hidden comment: RES SMD 13.7K OHM 1% 1/10W 0402)
R16  Tolerance: 1%  Resistance: 13.7kR  [R0402]  (hidden comment: RES SMD 13.7K OHM 1% 1/10W 0402)
R17  Tolerance: 1%  Resistance: 13.7kR  [R0402]  (hidden comment: RES SMD 13.7K OHM 1% 1/10W 0402)
R18  Tolerance: 1%  Resistance: 2.2kR  [R0402]  (hidden comment: RES SMD 2.2 KOHM 1% 1/10W 0402)
R19  Tolerance: 1%  Resistance: 24.3kR  [R0402]  (hidden comment: RES SMD 24.3 KOHM 1% 1/10W 0402)
R20  Tolerance: 1%  Resistance: 62R  [R0402]  (hidden comment: RES SMD 62 OHM 1% 1/10W 0402)
R21  Tolerance: 1%  Resistance: 62R  [R0402]  (hidden comment: RES SMD 62 OHM 1% 1/10W 0402)
R22  Tolerance: 1%  Resistance: 62R  [R0402]  (hidden comment: RES SMD 62 OHM 1% 1/10W 0402)
R23  Tolerance: 1%  Resistance: 62R  [R0402]  (hidden comment: RES SMD 62 OHM 1% 1/10W 0402)
R24  Tolerance: 1%  Resistance: 62R  [R0402]  (hidden comment: RES SMD 62 OHM 1% 1/10W 0402)
R25  Tolerance: 1%  Resistance: 62R  [R0402]  (hidden comment: RES SMD 62 OHM 1% 1/10W 0402)
R26  Tolerance: 1%  Resistance: 10 Ohm  [R0402]  (hidden comment: RES SMD 10 OHM 1% 1/16W 0402)
R27  Tolerance: 1%  Resistance: 10 Ohm  [R0402]  (hidden comment: RES SMD 10 OHM 1% 1/16W 0402)
R28  Tolerance: 1%  Resistance: 10 Ohm  [R0402]  (hidden comment: RES SMD 10 OHM 1% 1/16W 0402)
R29  Tolerance: 1%  Resistance: 10 Ohm  [R0402]  (hidden comment: RES SMD 10 OHM 1% 1/16W 0402)
R30  Tolerance: 1%  Resistance: 10 Ohm  [R0402]  (hidden comment: RES SMD 10 OHM 1% 1/16W 0402)
R31  Tolerance: 1%  Resistance: 10 Ohm  [R0402]  (hidden comment: RES SMD 10 OHM 1% 1/16W 0402)
R32  Tolerance: 1%  Resistance: 75kR  [R0402]  (hidden comment: RES SMD 75K OHM 1% 1/16W 0402)
R33  Tolerance: 1%  Resistance: 75kR  [R0402]  (hidden comment: RES SMD 75K OHM 1% 1/16W 0402)
R34  Tolerance: 1%  Resistance: 75kR  [R0402]  (hidden comment: RES SMD 75K OHM 1% 1/16W 0402)
R35  Tolerance: 1%  Resistance: 75kR  [R0402]  (hidden comment: RES SMD 75K OHM 1% 1/16W 0402)
R36  Tolerance: 1%  Resistance: 75kR  [R0402]  (hidden comment: RES SMD 75K OHM 1% 1/16W 0402)
R37  Tolerance: 1%  Resistance: 75kR  [R0402]  (hidden comment: RES SMD 75K OHM 1% 1/16W 0402)
R38  Resistance: 0.04R  Tolerance: 1%  [R2512]  (hidden comment: RES SMD 0.04 OHM 1% 2W 2512)
R39  Resistance: 0.04R  Tolerance: 1%  [R2512]  (hidden comment: RES SMD 0.04 OHM 1% 2W 2512)
R40  Resistance: 0.04R  Tolerance: 1%  [R2512]  (hidden comment: RES SMD 0.04 OHM 1% 2W 2512)
X?  NTC  pin_1: NTC+  pin_2: NTC-  [CONN_S2B-ZR_JST]  (masked out: inside a compile mask, not in the netlist)

### Ports
BLDC_NTC, HSU (in), HSV (in), HSW (in), LSU (in), LSV (in), LSW (in), OCCOMP (out), OP1N (out), OP1O (in), OP1P (out), OP2N (out), OP2O (in), OP2P (out), OP3N (out), OP3O (in), OP3P (out), PA3 (out), PA4 (out), PA5 (out), U (out), V (out), W (out)

### Nets
GND: C5.1 C6.1 C7.1 NT4.2 NT5.2 NT6.2 P1.5 P1.S1 P1.S2 R38.1 R39.1 R40.1
SIG-GND: C4.1 R9.1 R11.1 R14.1
VDD: R8.2 R10.2 R13.2 R19.2  [project net +3V3]
VM: C5.2 C6.2 C7.2 Q1.1D(D) Q2.1D(D) Q3.1D(D)
BLDC_NTC: P1.4 ; port BLDC_NTC
HSU: D5.1(C) R21.2 ; port HSU
HSV: D1.1(C) R20.2 ; port HSV
HSW: D3.1(C) R24.2 ; port HSW
LSU: D6.1(C) R22.2 ; port LSU
LSV: D2.1(C) R23.2 ; port LSV
LSW: D4.1(C) R25.2 ; port LSW
OCCOMP: C4.2 R4.2 R12.2 R18.2 R19.1 ; port OCCOMP
OP1N: C1.1 R5.2 R15.1 ; port OP1N
OP1O: C1.2 NT1.1 R15.2 ; port OP1O
OP1P: R1.2 R8.1 R9.2 ; port OP1P
OP2N: C2.1 R6.2 R16.1 ; port OP2N
OP2O: C2.2 NT2.1 R16.2 ; port OP2O
OP2P: R2.2 R10.1 R11.2 ; port OP2P
OP3N: C3.1 R7.2 R17.1 ; port OP3N
OP3O: C3.2 NT3.1 R17.2 ; port OP3O
OP3P: R3.2 R13.1 R14.2 ; port OP3P
PA3: NT1.2 ; port PA3
PA4: NT2.2 ; port PA4
PA5: NT3.2 ; port PA5
Phase-U: P1.1 Q1.1S(S) Q1.2D(D) R34.2 ; port U  [project net BLDC_U]
Phase-V: P1.2 Q2.1S(S) Q2.2D(D) R36.2 ; port V  [project net BLDC_V]
Phase-W: P1.3 Q3.1S(S) Q3.2D(D) R32.2 ; port W  [project net BLDC_W]
SENSE1_N: NT4.1 R5.1
SENSE1_P: Q1.2S(S) R1.1 R4.1 R35.2 R38.2
SENSE2_N: NT5.1 R6.1
SENSE2_P: Q2.2S(S) R2.1 R12.1 R37.2 R39.2
SENSE3_N: NT6.1 R7.1
SENSE3_P: Q3.2S(S) R3.1 R18.1 R33.2 R40.2
NetD1_2: D1.2(A) R28.1
NetD2_2: D2.2(A) R29.1
NetD3_2: D3.2(A) R30.1
NetD4_2: D4.2(A) R31.1
NetD5_2: D5.2(A) R26.1
NetD6_2: D6.2(A) R27.1
NetQ1_1G: Q1.1G(G) R21.1 R26.2 R34.1
NetQ1_2G: Q1.2G(G) R22.1 R27.2 R35.1
NetQ2_1G: Q2.1G(G) R20.1 R28.2 R36.1
NetQ2_2G: Q2.2G(G) R23.1 R29.2 R37.1
NetQ3_1G: Q3.1G(G) R24.1 R30.2 R32.1
NetQ3_2G: Q3.2G(G) R25.1 R31.2 R33.1

### Layout directives
differential pair: SENSE1_N, SENSE1_P, SENSE2_N, SENSE2_P, SENSE3_N, SENSE3_P

### Notes on the sheet
- -
- +
- INFO: Motor Peak < 4A = I2R = 4x4x0.04 = 0.64W
- Title:
- Size:
- A3
- Number:
- Date:
- File:
- Time:
- Revision:
- Sheet
- of

### Library data of the parts
C1-C3 = C 100pF 50V C0G, NP0 0402: 100pF ±5% 50V Ceramic Capacitor C0G, NP0 0402 (1005 Metric); Manufacturer: Yageo; Manufacturer Part Number: CC0402JRNPO9BN101; Temperature Coefficient: 30ppm/°C; Insulation Resistance: 100GR; Supplier 1: Digi-Key; Stock 1: 4235236; Pricing 1: 1=0.1, 10=0.02, 100=0.0089, 500=0.0064, 1000=0.005, 2500=0.0046, 5000=0.0042 (USD); Mount: Surface Mount; Case/Package: 0402; Number of Pins: 2; Case Code (Imperial): 0402; Case Code (Metric): 1005; Dielectric Material: Ceramic; Min Operating Temperature: -55°C; Max Operating Temperature: 125°C; Tolerance: 5%; Voltage Rating (DC): 50V; Packaging: Tape and Reel; Package Quantity: 1; Termination: SMD/SMT; Composition: Ceramic; Length: 1mm; Height: 0.5mm; Width: 0.5mm; Thickness: 0.022inch; Depth: 0.5mm; Radiation Hardening: No; REACH SVHC: No SVHC; Lead Free: Lead Free; ComponentLink1URL: http://www.farnell.com/datasheets/2213336.pdf?src-supplier=Newark; ComponentLink1Description: http://www.farnell.com/datasheets/2213336.pdf?src-supplier=Newark; ComponentLink2URL: http://www.yageo.com/documents/recent/UPY-GP_NP0_16V-to-50V_16.pdf?src-supplier=Digi-Key; ComponentLink2Description: http://www.yageo.com/documents/recent/UPY-GP_NP0_16V-to-50V_16.pdf?src-supplier=Digi-Key; ComponentLink3URL: http://documents.rs-components.com/techlib://itc_doclist_GB.htm?stockno=6698684&src-supplier=RSComponents; ComponentLink3Description: http://documents.rs-components.com/techlib://itc_doclist_GB.htm?stockno=6698684&src-supplier=RSComponents; ComponentLink4URL: http://www.yageo.com/documents/recent/UPY-GP_NP0_16V-to-50V_8.pdf?src-supplier=Avnet+Europe; ComponentLink4Description: http://www.yageo.com/documents/recent/UPY-GP_NP0_16V-to-50V_8.pdf?src-supplier=Avnet+Europe; ComponentLink5URL: http://www.farnell.com/datasheets/1443161.pdf?src-supplier=Element14; ComponentLink5Description: http://www.farnell.com/datasheets/1443161.pdf?src-supplier=Element14; ComponentLink6URL: http://www.farnell.com/datasheets/2213336.pdf?src-supplier=Element14; ComponentLink6Description: http://www.farnell.com/datasheets/2213336.pdf?src-supplier=Element14; Supplier Part Number 1: 311-1024-1-ND; Dielectric: C0G; Voltage Rating: 50V; Voltage: 50V
C4 = CAP CER 1000PF 50V X7R 0402: 1000pF ±10% 50V Ceramic Capacitor X7R 0402 (1005 Metric); Manufacturer: TDK-Lambda; Manufacturer Part Number: C0402C102K5RACTU; Supplier 1: Digi-Key; Stock 1: 1578852; Pricing 1: 1=0.1, 10=0.021, 50=0.0116, 100=0.0095, 500=0.0068, 1000=0.0053, 2500=0.0048, 5000=0.0045 (USD); Case/Package: 0402; Number of Pins: 2; Dielectric Material: Ceramic; Dielectric: X7R; Packaging: Cut Tape; Tolerance: 10%; Length: 1mm; Height: 500um; Width: 500um; REACH SVHC: No SVHC; ComponentLink1URL: http://www.onlinecomponents.com/productFiles/mf-KEM/kem_c1002_x7r_smd.pdf?src-supplier=Onlinecomponents.com; ComponentLink1Description: http://www.onlinecomponents.com/productFiles/mf-KEM/kem_c1002_x7r_smd.pdf?src-supplier=Onlinecomponents.com; Supplier Part Number 1: 399-1032-6-ND; Mount: Surface Mount
C5-C7 = CAP CER 220nF 100V X7R 0805: 220nF ±10% 100V Ceramic Capacitor X7R 0805 (2012 Metric); Manufacturer: KEMET; Manufacturer Part Number: C0805C224K1RECAUTO; Stock 1: 1006805; Pricing 1: 1=0.45, 10=0.312, 100=0.1875, 500=0.1406, 1000=0.1187 (USD); Mount: Surface Mount; Number of Pins: 2; Case Code (Metric): 2012; Case Code (Imperial): 0805; Min Operating Temperature: -55°C; Max Operating Temperature: 125°C; Packaging: Tape and Reel; Tolerance: 10%; Voltage Rating (DC): 100V; Dielectric: X7R; Termination: SMD/SMT; Package Quantity: 1; Composition: Ceramic; Length: 2mm; Height: 1.25mm; Width: 0.049inch; Thickness: 0.053inch; Depth: 1.25mm; Radiation Hardening: No; REACH SVHC: Unknown; ComponentLink1URL: https://content.kemet.com/datasheets/KEM_C1090_X7R_ESD.pdf; ComponentLink1Description: https://www.digikey.in/product-detail/en/kemet/C0805C224K1RECAUTO/399-17890-2-ND/8640484; Case/Package: 0805; Supplier 1: Digi-Key; Supplier Part Number 1: 399-17890-1-ND
D1-D6 = DIODE GEN PURP 75V 300mA: Diode Gen Purpose 75V 300mA Surface Mount SOD-323; Manufacturer: SMC Diode Solutions; Forward Voltage: 1V; Max Surge Current: 2.0A; Average Rectified Current: 150mA; Peak Reverse Current: 2.5uA; Element Configuration: Single; Manufacturer Part Number: 1N4148WSTR; Stock 1: 3984; Pricing 1: 1=0.48, 10=0.409, 100=0.3057, 500=0.2402, 1000=0.1856, 2500=0.1692, 5000=0.1583 (USD); ComponentLink1URL: http://www.smc-diodes.com/propdf/1N4148WS%20N0572%20REV.B.pdf; ComponentLink1Description: https://www.digikey.in/product-detail/en/smc-diode-solutions/1N4148WSTR/1655-1359-2-ND/6022449; Packaging: Tape and Reel; Mount: Surface Mount; Number of Pins: 2; Min Operating Temperature: -65°C; Max Operating Temperature: 100°C; Forward Current: 300mA; Package Quantity: 1; Max Repetitive Reverse Voltage (Vrrm): 75V; Peak Non-Repetitive Surge Current: 2.0A; Max Reverse Voltage (DC): 75V; Max Reverse Leakage Current: 2.5uA; Radiation Hardening: No; Lead Free: Lead Free; Supplier 1: Digi-Key; Supplier Part Number 1: 1655-1359-1-ND
NT1-NT6 = Net Tie Line: ClassName: STM32G473CETx
P1 = JST_S5B-ZR-SM4A-TF(LF)(SN): as P402 on sheet input-port-con; Manufacturer Part Number: S5B-ZR-SM4A-TF; Stock 1: 0; Mount: Surface Mount; Number of Pins: 4; Color: White; Contact Plating: Tin,Copper; Contact Material: Brass,Tin,Copper; Material: Nylon; Housing Color: Beige; Housing Material: Polyamide; Contact Shape: Circular; Insulation Material: Nylon; Insulation Color: Natural; Min Operating Temperature: -25°C; Max Operating Temperature: 85°C; Packaging: Bulk; Number of Rows: 1; Termination: Solder; Voltage Rating (DC): 50V; Current Rating: 1A; Voltage Rating (AC): 50V; Fastening Type: Detent; Max Voltage Rating (AC): 50V; Max Voltage Rating (DC): 50V; Number of Contacts: 4; Orientation: Right Angle; Length: 7.5mm; Height: 7.2mm; Width: 3.5mm; Depth: 6mm; Lead Pitch: 1.5mm; Contact Mating Length: 0.094inch; REACH SVHC: No SVHC; Lead Free: Lead Free; Flammability Rating: UL94 V-0; ComponentLink4URL: https://www.jst-mfg.com/product/pdf/eng/eZH.pdf; ComponentLink4Description: http://www.jst-mfg.com/product/pdf/eng/eZH.pdf?src-supplier=Digi-Key; Supplier 1: RSComponents
Q1-Q3 = ARRAY MOSFET 2N-CH 60V 33A POWERFLAT: Mosfet Array 2 N-Channel (Dual) 60V 33A 58W Surface Mount SOT-563; pin to pad: 1D>1D-A+1D-B 2D>2D-A+2D-B; Manufacturer: STMicroelectronics; Gate to Source Voltage (Vgs): 20V; Rds On Max: 27 mR; Input Capacitance: 420pF; Number of Channels: 2; Manufacturer Part Number: STL36DN6F7; Stock 1: 141366; Pricing 1: 1=0.39, 10=0.338, 25=0.3152, 100=0.234, 500=0.1827, 1000=0.1485 (USD); Mount: Surface Mount; Min Operating Temperature: -55°C; Max Operating Temperature: 175°C; Continuous Drain Current (ID): 33A; Package Quantity: 3000; Packaging: Tape and Reel; Drain to Source Voltage (Vdss): 60V; Max Power Dissipation: 58W; Drain to Source Breakdown Voltage: 60V; Drain to Source Resistance: 27 mR; Element Configuration: Dual; FET Type: 2 N-Channel; Length: 6.35mm; Height: 1mm; Width: 5.40mm; Radiation Hardening: No; REACH SVHC: No SVHC; Case/Package: POWERFLAT-5x6; Polarity: N-CHANNEL; Series: -; ClassName: TCPP; ComponentLink1Description: https://www.st.com/content/ccc/resource/technical/document/datasheet/group0/f7/13/0c/9e/7a/b2/47/d9/DM00224009/files/DM00224009.pdf/jcr:content/translations/en.DM00224009.pdf; ComponentLink1URL: https://www.st.com/content/ccc/resource/technical/document/datasheet/group0/f7/13/0c/9e/7a/b2/47/d9/DM00224009/files/DM00224009.pdf/jcr:content/translations/en.DM00224009.pdf; Supplier 1: Digi-Key; Supplier Part Number 1: 497-17308-1-ND
R1-R3 R5-R7 = RES SMD 1K OHM 1% 1/16W 0402: 1.78 kOhms ±1% 0.1W, 1/10W Chip Resistor 0402 (1005 Metric) Moisture Resistant Thick Film; Manufacturer: Yageo; Manufacturer Part Number: RT0402FRE071K78L; Temperature Coefficient: 100ppm/°C; Power Rating: 100mW; Voltage Rating: 50V; Stock 1: 9574509; Pricing 1: 1=0.1, 10=0.015, 100=0.0062, 1000=0.0028, 2500=0.0024, 5000=0.002 (USD); Case/Package: 0402; Number of Pins: 2; Case Code (Imperial): 0402; Case Code (Metric): 1005; Min Operating Temperature: -55°C; Max Operating Temperature: 155°C; Packaging: Tape and Reel; Composition: Thick Film; Voltage Rating (DC): 50V; Termination: SMD/SMT; Military Standard: Not; Length: 1mm; Height: 0.32mm; Width: 0.5mm; Depth: 0.5mm; REACH SVHC: Unknown; Lead Free: Lead Free; Mount: Surface Mount; Supplier 1: Mouser; Supplier Part Number 1: 603-RT0402FRE071K78L; Datasheet: https://www.mouser.com/datasheet/2/447/PYu_RT_1_to_0_01_RoHS_L_11-1669912.pdf
R4 R12 R18 = RES SMD 2.2 OHM 1% 1/16W 0402: 2.2 kOhms ±1% 0.100W, 1/10W Chip Resistor 0402 (1005 Metric) Moisture Resistant Thick Film; Manufacturer: Panasonic Electronic Components; Manufacturer Part Number: ERJ-2RKF2201X; Power Rating: 100mW; Voltage Rating: 50V; Temperature Coefficient: 200ppm/°C; Stock 1: 552576; Pricing 1: 1=0.1, 10=0.023, 100=0.0093, 1000=0.0042, 2500=0.0036, 5000=0.003 (USD); Case Code (Metric): 1005; Case Code (Imperial): 0402; Min Operating Temperature: -55°C; Max Operating Temperature: 155°C; Packaging: Tape and Reel; Composition: Thick Film; Termination: SMD/SMT; Length: 1mm; Height: 0.32mm; Width: 0.5mm; Depth: 0.5mm; REACH SVHC: No SVHC; Lead Free: Lead Free; Case/Package: 0402; Number of Pins: 2; Voltage Rating (DC): 50V; Mount: Surface Mount; Datasheet: https://industrial.panasonic.com/cdbs/www-data/pdf/RDA0000/AOA0000C304.pdf; Supplier 1: Digi-Key; Supplier Part Number 1: P2.20KLCT-ND
R8-R11 R13 R14 = RES SMD 1K OHM 1% 1/16W 0402: 27.4 kOhms ±1% 0.100W, 1/10W Chip Resistor 0402 (1005 Metric) Moisture Resistant Thick Film; Manufacturer: Panasonic Electronic Components; Manufacturer Part Number: ERJ-2RKF2742X; Temperature Coefficient: 100ppm/°C; Power Rating: 100mW; Voltage Rating: 50V; Stock 1: 9574509; Pricing 1: 1=0.1, 10=0.015, 100=0.0062, 1000=0.0028, 2500=0.0024, 5000=0.002 (USD); Case/Package: 0402; Number of Pins: 2; Case Code (Imperial): 0402; Case Code (Metric): 1005; Min Operating Temperature: -55°C; Max Operating Temperature: 155°C; Packaging: Tape and Reel; Composition: Thick Film; Voltage Rating (DC): 50V; Termination: SMD/SMT; Military Standard: Not; Length: 1mm; Height: 0.32mm; Width: 0.5mm; Depth: 0.5mm; REACH SVHC: Unknown; Lead Free: Lead Free; Mount: Surface Mount; Supplier 1: Digi-Key; Supplier Part Number 1: P27.4KLCT-ND; Datasheet: https://industrial.panasonic.com/cdbs/www-data/pdf/RDA0000/AOA0000C304.pdf
R15-R17 = RES SMD 1K OHM 1% 1/16W 0402: 13.7 kOhms ±1% 0.100W, 1/10W Chip Resistor 0402 (1005 Metric) Moisture Resistant Thick Film; Manufacturer: Panasonic Electronic Components; Manufacturer Part Number: ERJ-2RKF1372X; Temperature Coefficient: 100ppm/°C; Power Rating: 100mW; Voltage Rating: 50V; Stock 1: 9574509; Pricing 1: 1=0.1, 10=0.015, 100=0.0062, 1000=0.0028, 2500=0.0024, 5000=0.002 (USD); Case/Package: 0402; Number of Pins: 2; Case Code (Imperial): 0402; Case Code (Metric): 1005; Min Operating Temperature: -55°C; Max Operating Temperature: 155°C; Packaging: Tape and Reel; Composition: Thick Film; Voltage Rating (DC): 50V; Termination: SMD/SMT; Military Standard: Not; Length: 1mm; Height: 0.32mm; Width: 0.5mm; Depth: 0.5mm; REACH SVHC: Unknown; Lead Free: Lead Free; Mount: Surface Mount; Supplier 1: Digi-Key; Supplier Part Number 1: P13.7KLDKR-ND; Datasheet: https://industrial.panasonic.com/cdbs/www-data/pdf/RDA0000/AOA0000C304.pdf
R19 = RES SMD 2.2 OHM 1% 1/16W 0402: 24.3 kOhms ±1% 0.100W, 1/10W Chip Resistor 0402 (1005 Metric) Moisture Resistant Thick Film; Manufacturer: Panasonic Electronic Components; Manufacturer Part Number: ERJ-2RKF2432X; Power Rating: 100mW; Voltage Rating: 50V; Temperature Coefficient: 200ppm/°C; Stock 1: 552576; Pricing 1: 1=0.1, 10=0.023, 100=0.0093, 1000=0.0042, 2500=0.0036, 5000=0.003 (USD); Case Code (Metric): 1005; Case Code (Imperial): 0402; Min Operating Temperature: -55°C; Max Operating Temperature: 155°C; Packaging: Tape and Reel; Composition: Thick Film; Termination: SMD/SMT; Length: 1mm; Height: 0.32mm; Width: 0.5mm; Depth: 0.5mm; REACH SVHC: No SVHC; Lead Free: Lead Free; Case/Package: 0402; Number of Pins: 2; Voltage Rating (DC): 50V; Mount: Surface Mount; Datasheet: https://industrial.panasonic.com/cdbs/www-data/pdf/RDA0000/AOA0000C304.pdf; Supplier 1: Digi-Key; Supplier Part Number 1: P24.3KLCT-ND; Parameter 1: *
R20-R25 = RES SMD 62 OHM 1% 1/10W 0402: 62 Ohms ±1% 0.1W, 1/10W Chip Resistor 0402 (1005 Metric) Moisture Resistant Thick Film; Manufacturer: Panasonic Electronic Components; Manufacturer Part Number: ERJ-U02F62R0X; Power Rating: 100mW; Voltage Rating: 50V; Temperature Coefficient: 200ppm/°C; Stock 1: 453897; Pricing 1: 1=0.1, 10=0.015, 100=0.0062, 1000=0.0028, 2500=0.0024, 5000=0.002 (USD); Case/Package: 0402; Case Code (Imperial): 0402; Case Code (Metric): 1005; Min Operating Temperature: -55°C; Max Operating Temperature: 155°C; Packaging: Tape and Reel; Termination: SMD/SMT; Composition: Thick Film; Military Standard: Not; Length: 1mm; Height: 0.016inch; Width: 0.02inch; Depth: 0.5mm; Lead Free: Lead Free; Contact Plating: Tin,Matte; Number of Terminations: 2; Max Power Dissipation: 100mW; Features: Moisture Resistant; Mount: Surface Mount; ComponentLink1Description: https://industrial.panasonic.com/cdbs/www-data/pdf/RDP0000/AOA0000C334.pdf; ComponentLink1URL: https://industrial.panasonic.com/cdbs/www-data/pdf/RDP0000/AOA0000C334.pdf; Supplier 1: Digi-Key; Supplier Part Number 1: 10-ERJ-U02F62R0XCT-ND
R26-R31 = RES SMD 10 OHM 1% 1/16W 0402: 10 Ohms ±1% 0.063W, 1/16W Chip Resistor 0402 (1005 Metric) Automotive AEC-Q200, Moisture Resistant Thick Film; Manufacturer Part Number: AC0402FR-0710RL; Manufacturer: Yageo; Power Rating: 62.5mW; Voltage Rating: 50V; Max Power Dissipation: 63mW; Temperature Coefficient: 200ppm/°C; Supplier 1: Digi-Key; Stock 1: 212882; Pricing 1: 1=0.1, 10=0.03, 100=0.012, 1000=0.0054, 2500=0.0047, 5000=0.0039 (USD); Case/Package: 0402; Case Code (Imperial): 0402; Case Code (Metric): 1005; Min Operating Temperature: -55°C; Max Operating Temperature: 155°C; Packaging: Tape and Reel; Composition: Thick Film; Number of Terminations: 2; Termination: SMD/SMT; Features: Moisture Resistant,Automotive AEC-Q200; Length: 0.039inch; Height: 0.015inch; Width: 0.02inch; Lead Free: Lead Free; ComponentLink1URL: http://www.yageo.com/documents/recent/PYu-AC_51_RoHS_L_2_revised.pdf?src-supplier=Future+Electronics; ComponentLink1Description: http://www.yageo.com/documents/recent/PYu-AC_51_RoHS_L_2_revised.pdf?src-supplier=Future+Electronics; ComponentLink2URL: http://www.yageo.com/NewPortal/yageodocoutput?fileName=/pdf/R-Chip/PYu-AC_51_RoHS_L_6.pdf&src-supplier=Digi-Key; ComponentLink2Description: http://www.yageo.com/NewPortal/yageodocoutput?fileName=/pdf/R-Chip/PYu-AC_51_RoHS_L_6.pdf&src-supplier=Digi-Key; ComponentLink3URL: http://www.mouser.com/ds/2/447/yageodocoutput-1111992.pdf?src-supplier=Mouser; ComponentLink3Description: http://www.mouser.com/ds/2/447/yageodocoutput-1111992.pdf?src-supplier=Mouser; Supplier Part Number 1: YAG3438CT-ND; ClassName: STM32G473CETx; Mount: Surface Mount
R32-R37 = RES SMD 75K OHM 1% 1/16W 0402: 75 kOhms ±1% 0.063W, 1/16W Chip Resistor 0402 (1005 Metric) Automotive AEC-Q200 Thick Film; Manufacturer: Stackpole Electronics; Manufacturer Part Number: RMCF0402FT75K0; Power Rating: 63mW; Temperature Coefficient: 100ppm/°C; Supplier 1: Digi-Key; Stock 1: 24693; Pricing 1: 1=0.1, 10=0.014, 100=0.0058, 1000=0.0026, 2500=0.0023, 5000=0.0019 (USD); Mount: Surface Mount; Case/Package: 0402; Case Code (Metric): 1005; Case Code (Imperial): 0402; Contact Plating: Tin,Matte; Min Operating Temperature: -55°C; Max Operating Temperature: 155°C; Features: Automotive AEC-Q200; Packaging: Tape and Reel; Composition: Thick Film; Number of Terminations: 2; Military Standard: Not; Max Power Dissipation: 63mW; Length: 0.039inch; Height: 0.016inch; Width: 0.02inch; Depth: 0.5mm; Radiation Hardening: No; Lead Free: Lead Free; ComponentLink1URL: https://www.seielect.com/catalog/SEI-Packaging.pdf?src-supplier=Digi-Key; ComponentLink1Description: https://www.seielect.com/catalog/SEI-Packaging.pdf?src-supplier=Digi-Key; ComponentLink2URL: http://www.seielect.com/Catalog/Sei-RMC.pdf?src-supplier=Future+Electronics; ComponentLink2Description: http://www.seielect.com/Catalog/Sei-RMC.pdf?src-supplier=Future+Electronics; ComponentLink3URL: https://www.seielect.com/catalog/SEI-RMCF_RMCP.pdf?src-supplier=Avnet; ComponentLink3Description: https://www.seielect.com/catalog/SEI-RMCF_RMCP.pdf?src-supplier=Avnet; ComponentLink4URL: http://components.arrow.com/part/dataview/47811039S7743759N1174?src-supplier=Arrow; ComponentLink4Description: http://components.arrow.com/part/dataview/47811039S7743759N1174?src-supplier=Arrow; ComponentLink5URL: https://www.verical.com/server-webapp/html/getDatasheet?partID=492569&src-supplier=Verical; ComponentLink5Description: https://www.verical.com/server-webapp/html/getDatasheet?partID=492569&src-supplier=Verical; Supplier Part Number 1: RMCF0402FT75K0CT-ND; ClassName: STM32G473CETx
R38-R40 = RES SMD 0.04 OHM 1% 2W 2512: 0.04 Ohms ±1% 2W Chip Resistor 2512 (6432 Metric); Manufacturer: Stackpole Electronics Inc; Manufacturer Part Number: CSRN2512FK40L0; Temperature Coefficient: 200ppm/°C; Voltage Rating: 200V; Stock 1: 19521; Pricing 1: 1=0.34, 10=0.292, 100=0.114, 1000=0.0477 (USD); Case/Package: 2512; Number of Pins: 2; Case Code (Metric): 6432; Case Code (Imperial): 2512; Contact Plating: Tin; Min Operating Temperature: -55°C; Max Operating Temperature: 155°C; Package Quantity: 2000; Power Rating: 2W; Packaging: Tape and Reel; Composition: Thick Film; Number of Terminations: 2; Termination: SMD/SMT; Military Standard: Not; Max Power Dissipation: 2W; Length: 6.3mm; Height: 0.6mm; Width: 3.15mm; Depth: 3.15mm; Radiation Hardening: No; REACH SVHC: Unknown; Lead Free: Lead Free; ComponentLink1URL: https://www.seielect.com/catalog/sei-csr_csrn.pdf; ComponentLink1Description: https://www.digikey.in/product-detail/en/stackpole-electronics-inc/CSRN2512FK40L0/CSRN2512FK40L0TR-ND/1788108; Weight: 0.001429oz; Number of Terminals: 2; Voltage Rating (DC): 200V; Mount: Surface Mount; Supplier 1: Digi-Key; Supplier Part Number 1: CSRN2512FK40L0CT-ND
X? = CONN HEADER TH R/A 2POS 1.5MM: Connector Header Through Hole, Right Angle 2 position 0.059" (1.50mm); Manufacturer: JST; Manufacturer Part Number: S2B-ZR(LF)(SN); Body Plating: Tin; Number of Positions: 2; Gender: Male; Connector Type: Male Pin; Current Rating: 1A; Contact Resistance: 30mR; Voltage Rating: 50V; Insulation Resistance: 500MR; Pitch: 1.5mm; Panel Thickness: 3.5mm; Supplier 1: Digi-Key; Stock 1: 14685; Pricing 1: 1=0.19, 10=0.177, 100=0.109, 500=0.0902, 1000=0.079, 5000=0.0677, 10000=0.0658 (USD); Mount: Through Hole; Number of Pins: 2; Contact Plating: Tin,Copper; Contact Material: Brass,Tin,Copper; Color: Natural,White; Housing Color: Beige; Housing Material: Polyamide; Material: Nylon; Min Operating Temperature: -25°C; Max Operating Temperature: 85°C; Termination: Press-Fit; Number of Rows: 1; Packaging: Bulk; Fastening Type: Detent; Number of Contacts: 2; Orientation: Right Angle; Voltage Rating (AC): 50V; Voltage Rating (DC): 50V; Max Current Rating: 1A; Max Voltage Rating (AC): 50V; Length: 4.5mm; Height: 7.2mm; Width: 3.5mm; Contact Mating Length: 0.094inch; Depth: 6mm; Lead Pitch: 1.5mm; Lead Free: Lead Free; Flammability Rating: UL94 V-0; REACH SVHC: No SVHC; ComponentLink1URL: http://www.farnell.com/datasheets/80556.pdf?src-supplier=Element14; ComponentLink1Description: http://www.farnell.com/datasheets/80556.pdf?src-supplier=Element14; ComponentLink2URL: http://www1.futureelectronics.com/doc/JST/S2B-ZR(LF)(SN).pdf?src-supplier=Future+Electronics; ComponentLink2Description: http://www1.futureelectronics.com/doc/JST/S2B-ZR(LF)(SN).pdf?src-supplier=Future+Electronics; ComponentLink3URL: http://www.jst-mfg.com/product/pdf/eng/eZH.pdf?src-supplier=Digi-Key; ComponentLink3Description: http://www.jst-mfg.com/product/pdf/eng/eZH.pdf?src-supplier=Digi-Key; ComponentLink4URL: https://www.verical.com/server-webapp/html/getDatasheet?partID=687340&src-supplier=Verical; ComponentLink4Description: https://www.verical.com/server-webapp/html/getDatasheet?partID=687340&src-supplier=Verical; Supplier Part Number 1: 455-1669-ND

## Sheet SWD_TagConnect.SchDoc: Tag-Connect SWD Port
size A4; DocumentNumber: 5; SheetNumber: 5; SheetTotal: 8
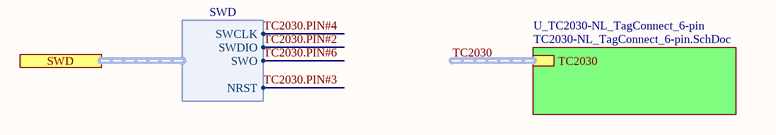
[diagram p5: SWD_TagConnect.SchDoc]

### Sub-sheets
U_TC2030-NL_TagConnect_6-pin = TC2030-NL_TagConnect_6-pin.SchDoc: TC2030 (harness TC2030)

### Ports
SWD (harness SWD)

### Harnesses
SWD: SWDIO, SWCLK, NRST, SWO

### Buses and harness runs
harness TC2030 = sheet U_TC2030-NL_TagConnect_6-pin/TC2030

### Notes on the sheet
- Title:
- Number:
- Size:
- Date:
- A4
- Time:
- Revision:
- Sheet
- File:
- of